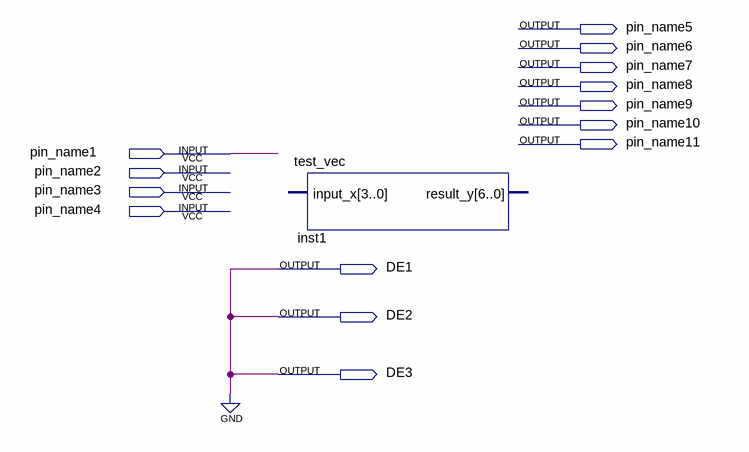
[diagram p0: schematic sheet]
// Quartus schematic seven_with_VHDL.bdf as structural Verilog: 1 symbols, 14 pins
module seven_with_VHDL (
  input  pin_name1,
  input  pin_name2,
  input  pin_name3,
  input  pin_name4,
  output pin_name5,
  output pin_name6,
  output pin_name7,
  output pin_name8,
  output pin_name9,
  output pin_name10,
  output pin_name11,
  output DE1,
  output DE2,
  output DE3
);

  test_vec inst1 ();  // open: input_x, result_y

  assign DE1 = 1'b0;
  assign DE2 = 1'b0;
  assign DE3 = 1'b0;
endmodule
